# EAGLE schematic imu-adapter (EAGLE 6.2)
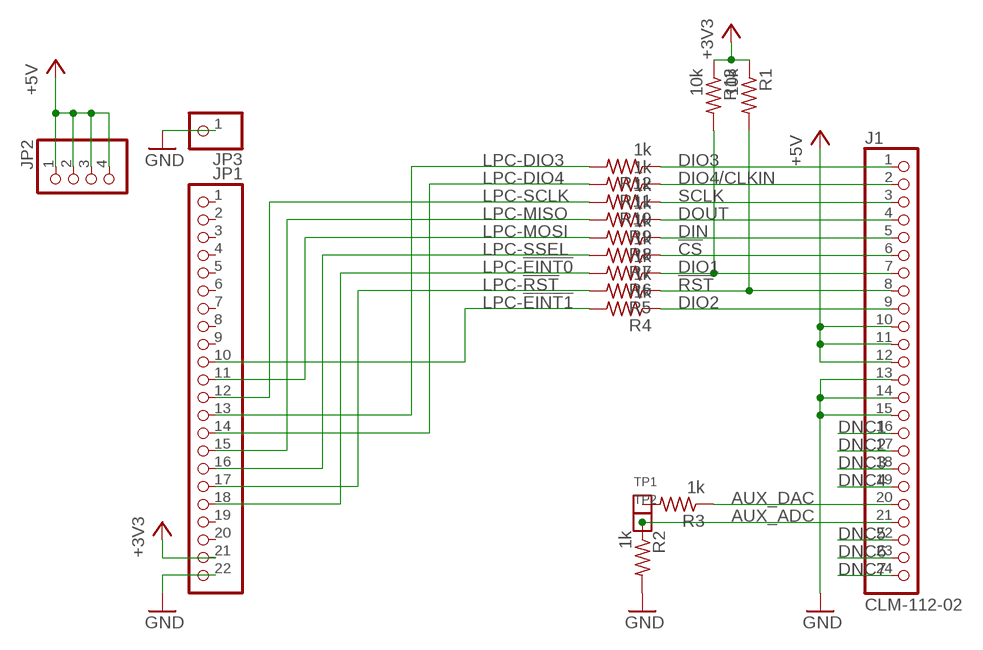
[diagram p0: schematic, sheet 1]

## Parts
J1  CLM-112-02  [CLM-112-02-XX-D-A]
JP1  PINHD-1X22  [1X22]
JP2  PINHD-1X4  [1X04]
JP3  PINHD-1X1  [1X01]
R1  10k  R-US_0603-B-NOSILK  [0603-B-NOSILK]
R2  1k  R-US_0603-B-NOSILK  [0603-B-NOSILK]
R3  1k  R-US_0603-B-NOSILK  [0603-B-NOSILK]
R4  1k  R-US_0603-B-NOSILK  [0603-B-NOSILK]
R5  1k  R-US_0603-B-NOSILK  [0603-B-NOSILK]
R6  1k  R-US_0603-B-NOSILK  [0603-B-NOSILK]
R7  1k  R-US_0603-B-NOSILK  [0603-B-NOSILK]
R8  1k  R-US_0603-B-NOSILK  [0603-B-NOSILK]
R9  1k  R-US_0603-B-NOSILK  [0603-B-NOSILK]
R10  1k  R-US_0603-B-NOSILK  [0603-B-NOSILK]
R11  1k  R-US_0603-B-NOSILK  [0603-B-NOSILK]
R12  1k  R-US_0603-B-NOSILK  [0603-B-NOSILK]
R13  10k  R-US_0603-B-NOSILK  [0603-B-NOSILK]
TP1  TEST-POINT  [2MM-TEST-POINT]
TP2  TEST-POINT  [2MM-TEST-POINT]

## Nets
!CS: J1.6 R7.1
!RST: J1.8 R1.2 R5.1
+3V3: JP1.21 R1.1 R13.1
+5V: J1.10 J1.11 J1.12 JP2.1 JP2.2 JP2.3 JP2.4
AUX_ADC: J1.21 R2.1 TP2.1
AUX_DAC: J1.20 R3.1
DIN: J1.5 R8.1
DIO1: J1.7 R6.1 R13.2
DIO2: J1.9 R4.1
DIO3: J1.1 R12.1
DIO4/CLKIN: J1.2 R11.1
DNC1: J1.16
DNC2: J1.17
DNC3: J1.18
DNC4: J1.19
DNC5: J1.22
DNC6: J1.23
DNC7: J1.24
DOUT: J1.4 R9.1
GND: J1.13 J1.14 J1.15 JP1.22 JP3.1 R2.2
LPC-!EINT0: JP1.18 R6.2
LPC-!EINT1: JP1.10 R4.2
LPC-!RST: JP1.17 R5.2
LPC-DIO3: JP1.13 R12.2
LPC-DIO4: JP1.14 R11.2
LPC-MISO: JP1.15 R9.2
LPC-MOSI: JP1.11 R8.2
LPC-SCLK: JP1.12 R10.2
LPC-SSEL: JP1.16 R7.2
N$1: R3.2 TP1.1
SCLK: J1.3 R10.1
Unconnected: JP1.1 JP1.2 JP1.3 JP1.4 JP1.5 JP1.6 JP1.7 JP1.8 JP1.9 JP1.19 JP1.20

## Library data of the parts
J1 = samtec-clm-112-02:CLM-112-02: Samtec 24 pin (12x2) 1.0 mm connector
JP1 = pinhead:PINHD-1X22: PIN HEADER
JP2 = pinhead:PINHD-1X4: PIN HEADER
JP3 = pinhead:PINHD-1X1: PIN HEADER
R1-R13 = rcl_custom:R-US_: RESISTOR, American symbol
TP1 TP2 = Tova:TEST-POINT